# Altium schematic sheet 01-AD9546-Main.SchDoc
size A; SheetNumber: 4; SheetTotal: 16
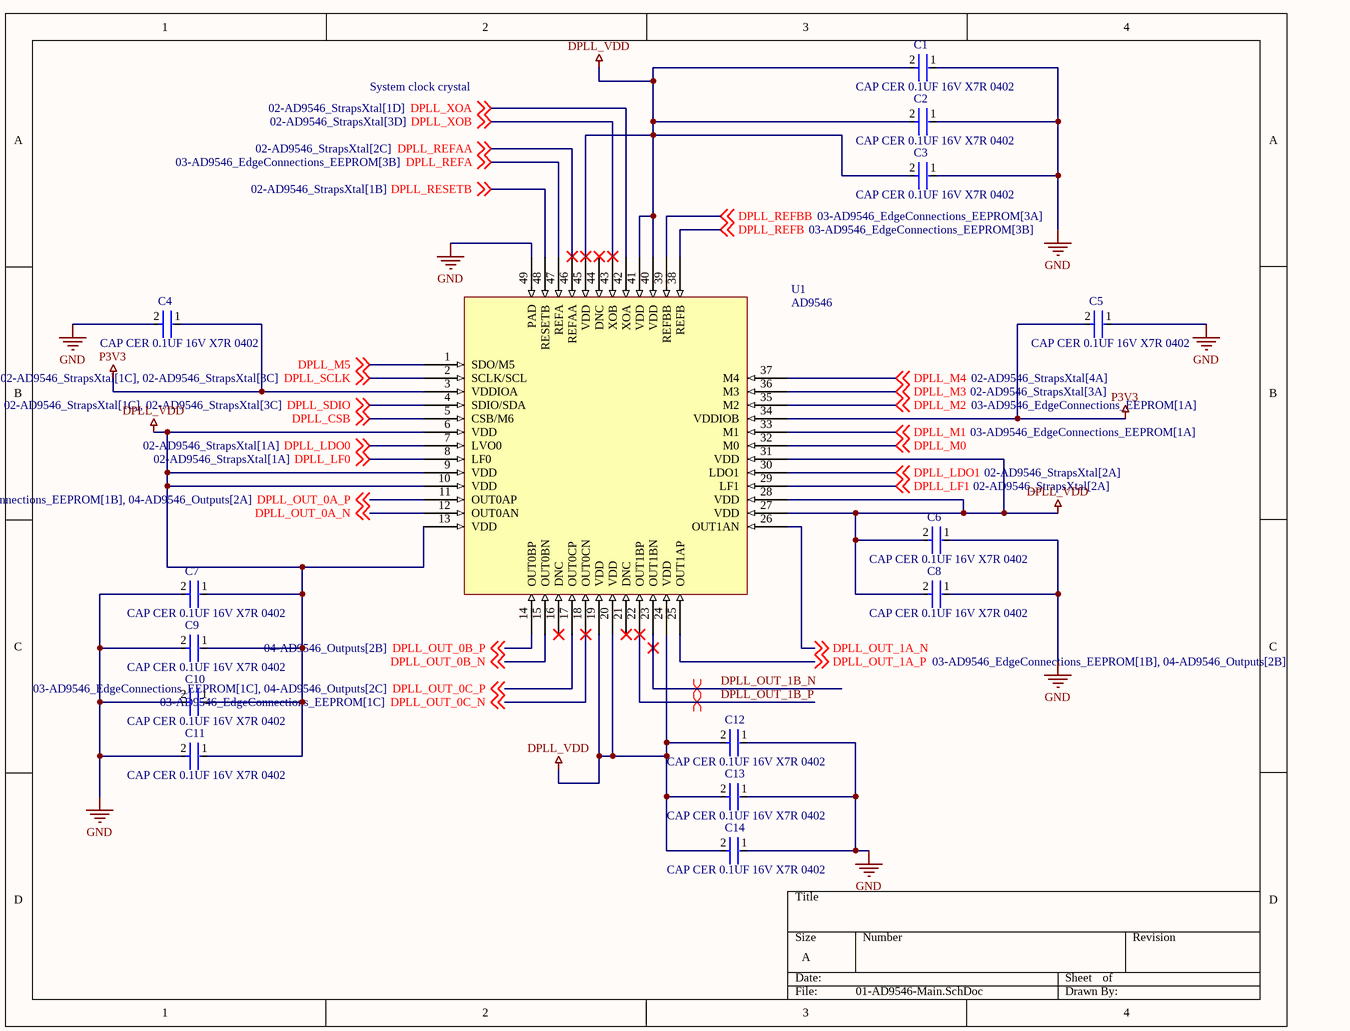
[diagram p0: 01-AD9546-Main.SchDoc]

## Parts
C1  GRM155R71C104KA88D  [FP-GRM15-MFG]  (value not drawn)
C2  GRM155R71C104KA88D  [FP-GRM15-MFG]  (value not drawn)
C3  GRM155R71C104KA88D  [FP-GRM15-MFG]  (value not drawn)
C4  GRM155R71C104KA88D  [FP-GRM15-MFG]  (value not drawn)
C5  GRM155R71C104KA88D  [FP-GRM15-MFG]  (value not drawn)
C6  GRM155R71C104KA88D  [FP-GRM15-MFG]  (value not drawn)
C7  GRM155R71C104KA88D  [FP-GRM15-MFG]  (value not drawn)
C8  GRM155R71C104KA88D  [FP-GRM15-MFG]  (value not drawn)
C9  GRM155R71C104KA88D  [FP-GRM15-MFG]  (value not drawn)
C10  GRM155R71C104KA88D  [FP-GRM15-MFG]  (value not drawn)
C11  GRM155R71C104KA88D  [FP-GRM15-MFG]  (value not drawn)
C12  GRM155R71C104KA88D  [FP-GRM15-MFG]  (value not drawn)
C13  GRM155R71C104KA88D  [FP-GRM15-MFG]  (value not drawn)
C14  GRM155R71C104KA88D  [FP-GRM15-MFG]  (value not drawn)
U1  AD9546  [AD9546]

## Nets
DPLL_VDD: C1.2 C2.2 C3.2 C6.2 C7.1 C8.2 C9.1 C10.1 C11.1 C12.2 C13.2 C14.2 U1.6(VDD) U1.9(VDD) U1.10(VDD) U1.13(VDD) U1.19(VDD) U1.20(VDD) U1.24(VDD) U1.27(VDD) U1.28(VDD) U1.31(VDD) U1.40(VDD) U1.41(VDD) U1.45(VDD)
GND: C1.1 C2.1 C3.1 C4.2 C5.1 C6.1 C7.2 C8.1 C9.2 C10.2 C11.2 C12.1 C13.1 C14.1 U1.49(PAD)
P3V3: C4.1 C5.2 U1.3(VDDIOA) U1.34(VDDIOB)
DPLL_CSB: U1.5(CSB/M6) ; off-sheet DPLL_CSB
DPLL_LDO0: U1.7(LVO0) ; off-sheet DPLL_LDO0
DPLL_LDO1: U1.30(LDO1) ; off-sheet DPLL_LDO1
DPLL_LF0: U1.8(LF0) ; off-sheet DPLL_LF0
DPLL_LF1: U1.29(LF1) ; off-sheet DPLL_LF1
DPLL_M0: U1.32(M0) ; off-sheet DPLL_M0
DPLL_M1: U1.33(M1) ; off-sheet DPLL_M1
DPLL_M2: U1.35(M2) ; off-sheet DPLL_M2
DPLL_M3: U1.36(M3) ; off-sheet DPLL_M3
DPLL_M4: U1.37(M4) ; off-sheet DPLL_M4
DPLL_M5: U1.1(SDO/M5) ; off-sheet DPLL_M5
DPLL_OUT_0A_N: U1.12(OUT0AN) ; off-sheet DPLL_OUT_0A_N
DPLL_OUT_0A_P: U1.11(OUT0AP) ; off-sheet DPLL_OUT_0A_P
DPLL_OUT_0B_N: U1.15(OUT0BN) ; off-sheet DPLL_OUT_0B_N
DPLL_OUT_0B_P: U1.14(OUT0BP) ; off-sheet DPLL_OUT_0B_P
DPLL_OUT_0C_N: U1.18(OUT0CN) ; off-sheet DPLL_OUT_0C_N
DPLL_OUT_0C_P: U1.17(OUT0CP) ; off-sheet DPLL_OUT_0C_P
DPLL_OUT_1A_N: U1.26(OUT1AN) ; off-sheet DPLL_OUT_1A_N
DPLL_OUT_1A_P: U1.25(OUT1AP) ; off-sheet DPLL_OUT_1A_P
DPLL_OUT_1B_N: U1.23(OUT1BN)
DPLL_OUT_1B_P: U1.22(OUT1BP)
DPLL_REFA: U1.47(REFA) ; off-sheet DPLL_REFA
DPLL_REFAA: U1.46(REFAA) ; off-sheet DPLL_REFAA
DPLL_REFB: U1.38(REFB) ; off-sheet DPLL_REFB
DPLL_REFBB: U1.39(REFBB) ; off-sheet DPLL_REFBB
DPLL_RESETB: U1.48(RESETB) ; off-sheet DPLL_RESETB
DPLL_SCLK: U1.2(SCLK/SCL) ; off-sheet DPLL_SCLK
DPLL_SDIO: U1.4(SDIO/SDA) ; off-sheet DPLL_SDIO
DPLL_XOA: U1.42(XOA) ; off-sheet DPLL_XOA
DPLL_XOB: U1.43(XOB) ; off-sheet DPLL_XOB

Not connected (* = marked no-connect by the designer): U1 16(DNC)* 21(DNC)* 44(DNC)*

## Layout directives
differential pair; differential pair class 100ohm: DPLL_OUT_1B_N, DPLL_OUT_1B_P

## Notes on the sheet
- System clock crystal

## Library data of the parts
C1-C14 = CMP-2100-03641-2: CAP CER 0.1UF 16V X7R 0402; Manufacturer: Murata; Standoff Height: 0mm; Tolerance: 10%; Voltage Rating: 16Vdc; Material: Ceramic; Capacitance: 0.10μF; Value: 0.10μF; RoHS: TRUE; Manufacturer Part Number: GRM155R71C104KA88D; Temperature Characteristic: X7R; Octopart: https://octopart.com/grm155r71c104ka88d-murata-196880; Digikey Description: CAP CER 0.1UF 16V X7R 0402; Device Class L3: Ceramic Capacitors; Height: 0.55mm; ComponentLink2Description: Datasheet; Temperature Range Low: -55°C; Ipc Land Pattern Name: CAPC10050X219; ComponentLink2URL: https://search.murata.co.jp/Ceramy/image/img/A01X/G101/ENG/GRM155R71H471KA01-01A.pdf; Device Class L1: Passive Components; Lead Free: yes; Category: Cap; Package: GRM15; Temperature: -55°C to +125°C; Device Class L2: Capacitors; Temperature Range High: +125°C; Mouser Description: 0402 0.1 uF 16V ±10 % Tolerance X7R SMT Multilayer Ceramic Capacitor